# Altium schematic sheet MCU_USB.SchDoc
size A2; SheetNumber: 3; SheetTotal: 7
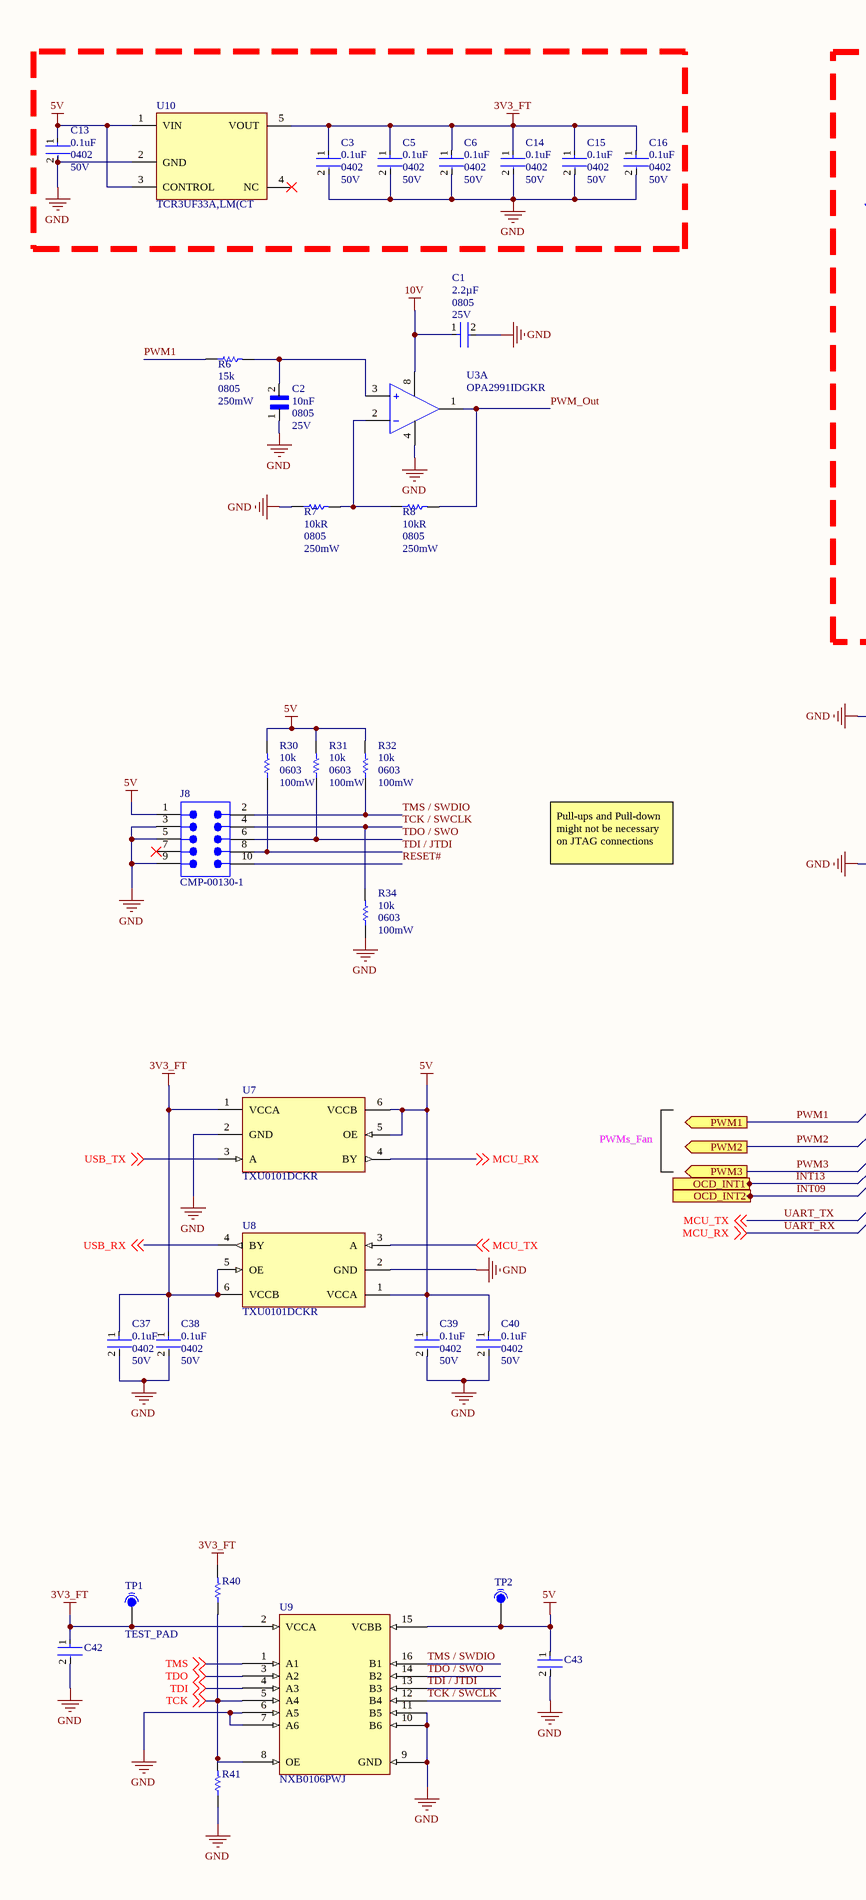
[diagram p0: MCU_USB.SchDoc, left]
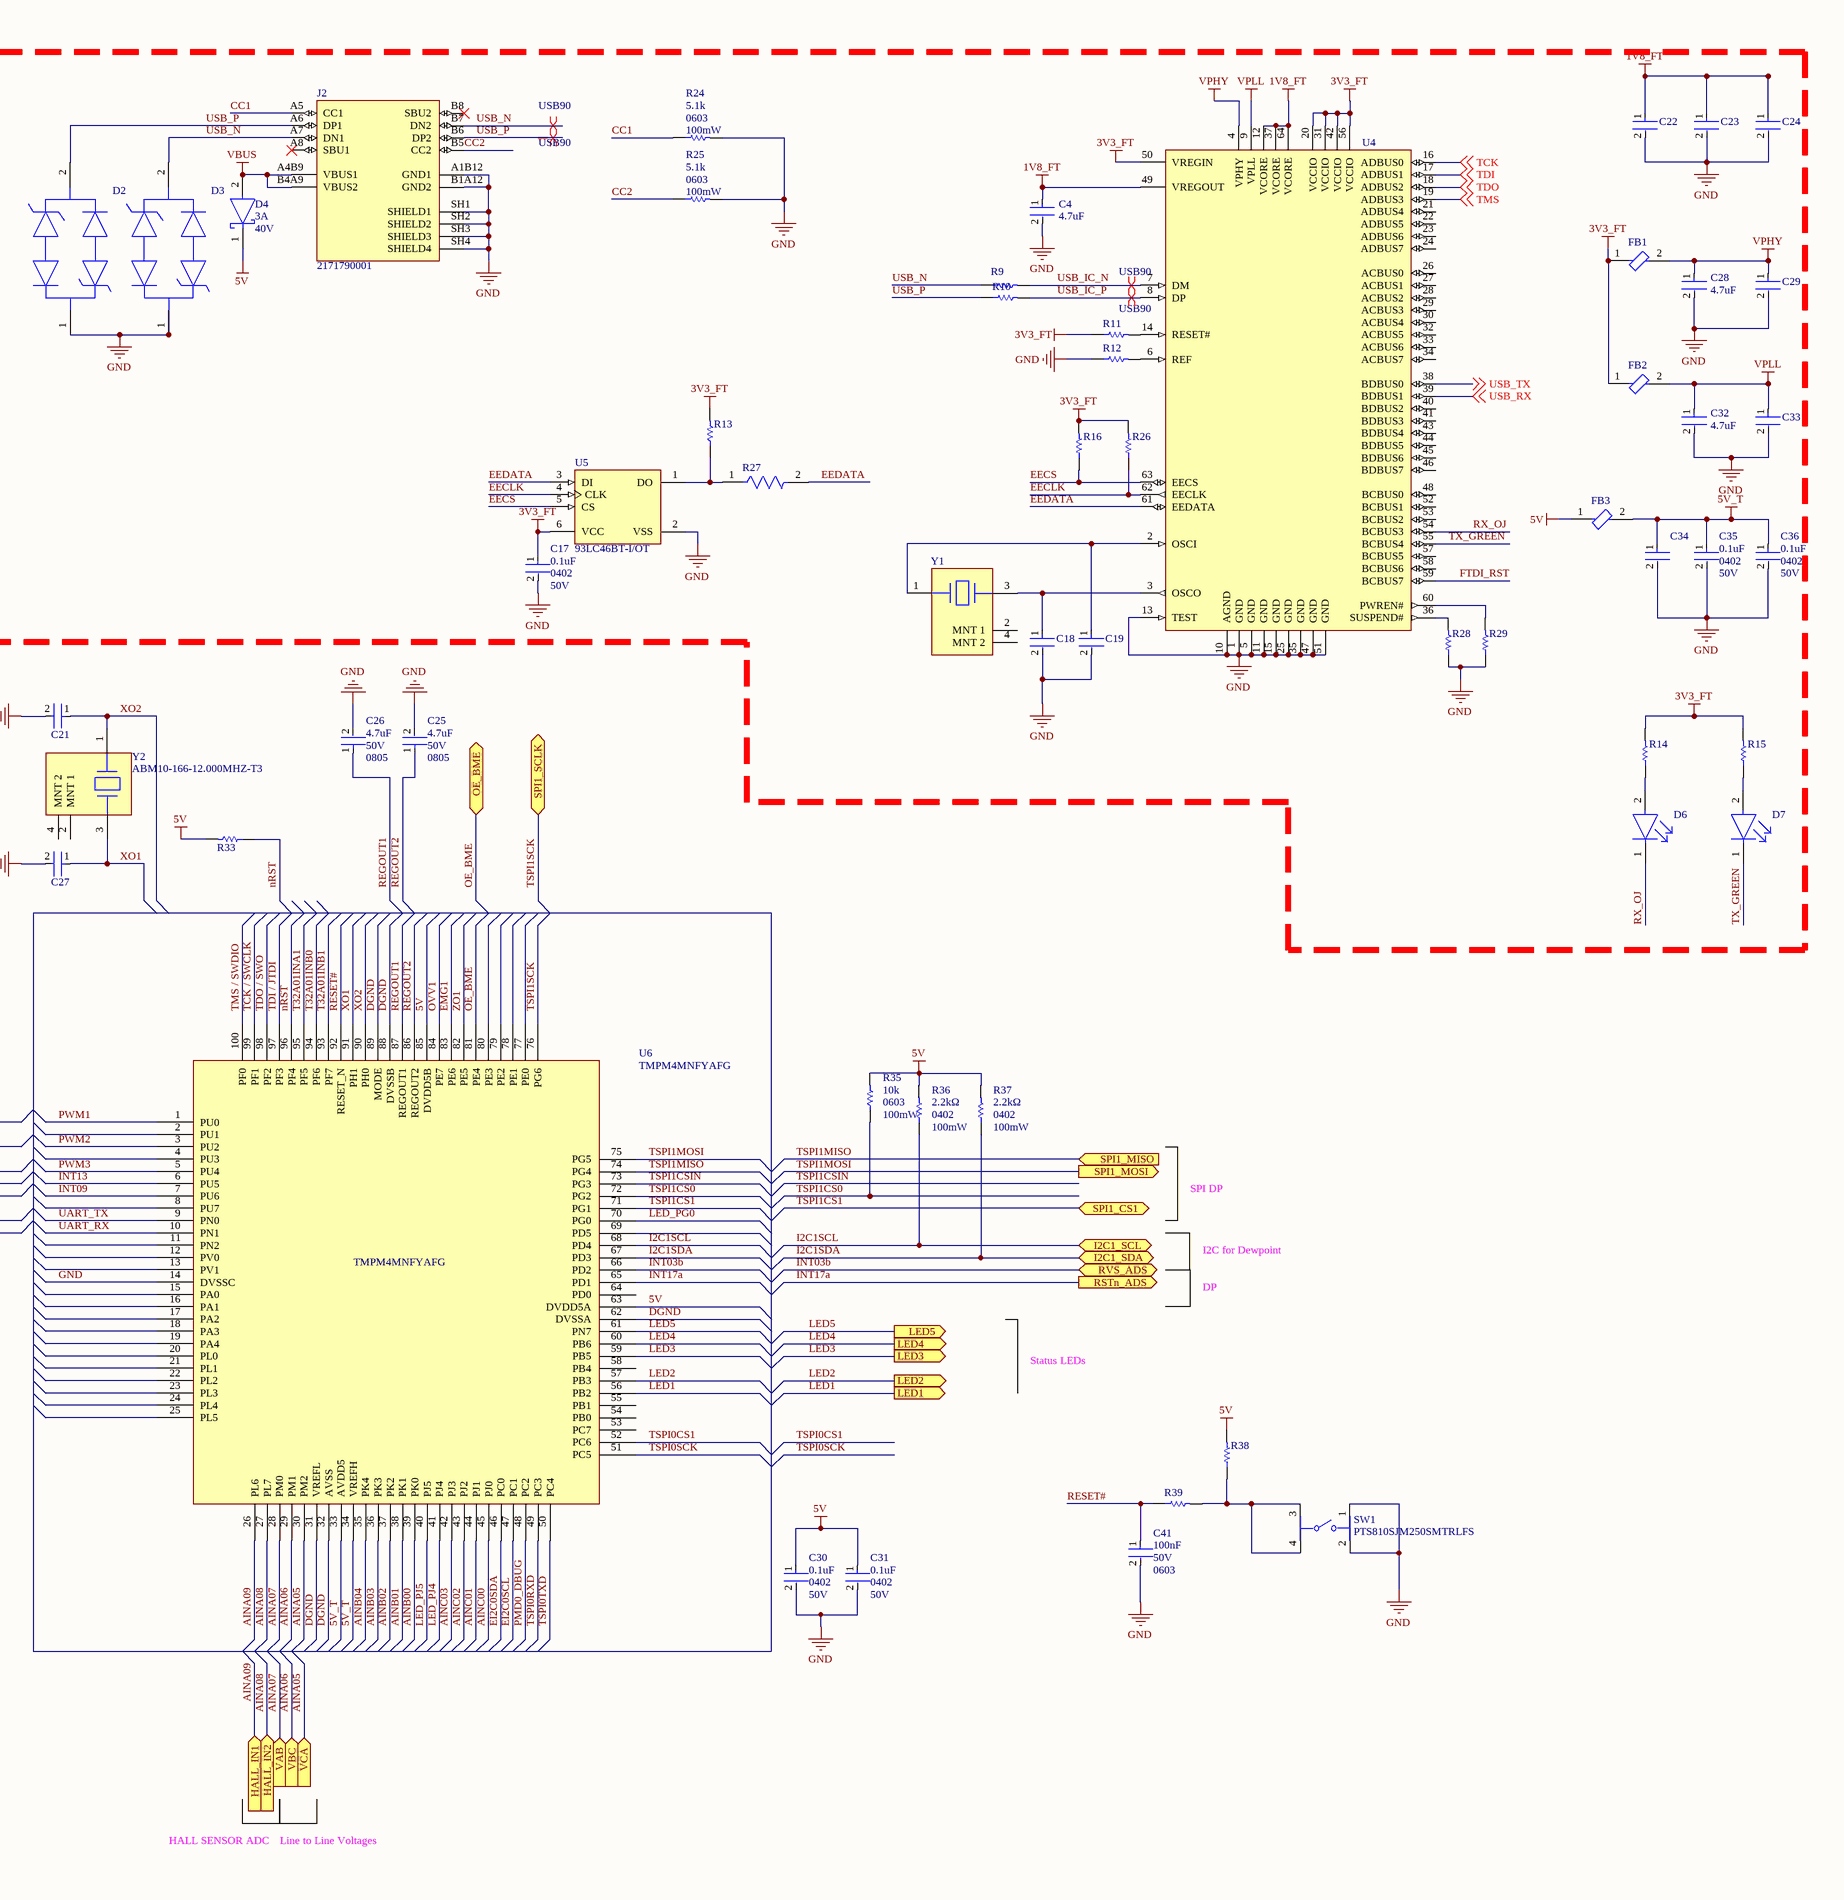
[diagram p1: MCU_USB.SchDoc, right]

## Parts
C1  value 2.2µF  Case/Package: 0805  Voltage Rating: 25V  [FP-0805-L_2_01_0_2-W_1_25-IPC_A]  (hidden comment: 08053C225KAT2A)
C2  value 10nF  Case/Package: 0805  Voltage Rating: 25V  [C0805C103J3GECAUTO-Footprint-1]  (hidden comment: C0805C103J3GECAUTO)
C3  value 0.1uF  Rating: 50V  Package: 0402  [FP-CGA2B-MFG]  (hidden comment: CGA2B3X7R1H104K050BB)
C4  Capacitance: 4.7uF  [FP-GRM21B-0_15-IPC_B]  (hidden comment: GRM21BR61H475KE51L)
C5  value 0.1uF  Rating: 50V  Package: 0402  [FP-CGA2B-MFG]  (hidden comment: CGA2B3X7R1H104K050BB)
C6  value 0.1uF  Rating: 50V  Package: 0402  [FP-CGA2B-MFG]  (hidden comment: CGA2B3X7R1H104K050BB)
C13  value 0.1uF  Rating: 50V  Package: 0402  [FP-CGA2B-MFG]  (hidden comment: CGA2B3X7R1H104K050BB)
C14  value 0.1uF  Rating: 50V  Package: 0402  [FP-CGA2B-MFG]  (hidden comment: CGA2B3X7R1H104K050BB)
C15  value 0.1uF  Rating: 50V  Package: 0402  [FP-CGA2B-MFG]  (hidden comment: CGA2B3X7R1H104K050BB)
C16  value 0.1uF  Rating: 50V  Package: 0402  [FP-CGA2B-MFG]  (hidden comment: CGA2B3X7R1H104K050BB)
C17  value 0.1uF  Rating: 50V  Package: 0402  [FP-CGA2B-MFG]  (hidden comment: CGA2B3X7R1H104K050BB)
C18  CBR08C809CAGAC  [FP-CBR08C-MFG]  (value not drawn)
C19  CBR08C809CAGAC  [FP-CBR08C-MFG]  (value not drawn)
C21  C0805C180K5GACTU  [FP-C0805C-DN-MFG]  (value not drawn)
C22  08055C104KAT2A  [FP-0805-L_2_01_0_2-W_1_25-IPC_C]  (value not drawn)
C23  08055C104KAT2A  [FP-0805-L_2_01_0_2-W_1_25-IPC_C]  (value not drawn)
C24  08055C104KAT2A  [FP-0805-L_2_01_0_2-W_1_25-IPC_C]  (value not drawn)
C25  Case/Package: 0805  Capacitance: 4.7uF  Voltage Rating: 50V  [FP-GRM21B-0_15-IPC_B]  (hidden comment: GRM21BR61H475KE51L)
C26  Case/Package: 0805  Capacitance: 4.7uF  Voltage Rating: 50V  [FP-GRM21B-0_15-IPC_B]  (hidden comment: GRM21BR61H475KE51L)
C27  C0805C180K5GACTU  [FP-C0805C-DN-MFG]  (value not drawn)
C28  Capacitance: 4.7uF  [FP-GRM21B-0_15-IPC_B]  (hidden comment: GRM21BR61H475KE51L)
C29  08055C104KAT2A  [FP-0805-L_2_01_0_2-W_1_25-IPC_C]  (value not drawn)
C30  value 0.1uF  Rating: 50V  Package: 0402  [FP-CGA2B-MFG]  (hidden comment: CGA2B3X7R1H104K050BB)
C31  value 0.1uF  Rating: 50V  Package: 0402  [FP-CGA2B-MFG]  (hidden comment: CGA2B3X7R1H104K050BB)
C32  Capacitance: 4.7uF  [FP-GRM21B-0_15-IPC_B]  (hidden comment: GRM21BR61H475KE51L)
C33  08055C104KAT2A  [FP-0805-L_2_01_0_2-W_1_25-IPC_C]  (value not drawn)
C34  GRM21BR61C106KE15K  [FP-GRM21B-0_1-MFG]  (value not drawn)
C35  value 0.1uF  Rating: 50V  Package: 0402  [FP-CGA2B-MFG]  (hidden comment: CGA2B3X7R1H104K050BB)
C36  value 0.1uF  Rating: 50V  Package: 0402  [FP-CGA2B-MFG]  (hidden comment: CGA2B3X7R1H104K050BB)
C37  value 0.1uF  Rating: 50V  Package: 0402  [FP-CGA2B-MFG]  (hidden comment: CGA2B3X7R1H104K050BB)
C38  value 0.1uF  Rating: 50V  Package: 0402  [FP-CGA2B-MFG]  (hidden comment: CGA2B3X7R1H104K050BB)
C39  value 0.1uF  Rating: 50V  Package: 0402  [FP-CGA2B-MFG]  (hidden comment: CGA2B3X7R1H104K050BB)
C40  value 0.1uF  Rating: 50V  Package: 0402  [FP-CGA2B-MFG]  (hidden comment: CGA2B3X7R1H104K050BB)
C41  value 100nF  Voltage Rating: 50V  Case/Package: 0603  [FP-C0603C-CF-IPC_A]  (hidden comment: C0603C104K5RACTU)
C42  08055C104KAT2A  [FP-0805-L_2_01_0_2-W_1_25-IPC_C]  (value not drawn)
C43  08055C104KAT2A  [FP-0805-L_2_01_0_2-W_1_25-IPC_C]  (value not drawn)
D2  CDSOD323-T05C  [FP-SOD-323-IPC_A]  (value not drawn)
D3  CDSOD323-T05C  [FP-SOD-323-IPC_A]  (value not drawn)
D4  value 3A  Voltage Rating: 40V  [FP-SOD123W-MFG]  (hidden comment: PMEG4030ER,115)
D6  APT3216LSECK/J4-PRV  [FP-APT3216LSECK-J4-PRV-MFG]  (value not drawn)
D7  APT3216LZGCK  [FP-APT3216LSECK-J4-PRV-MFG]  (value not drawn)
FB1  BLM21PG300SN1D  [FP-BLM21-0_2-t0_85-e0_5-d-MFG]  (value not drawn)
FB2  BLM21PG300SN1D  [FP-BLM21-0_2-t0_85-e0_5-d-MFG]  (value not drawn)
FB3  MPZ2012S221AT000  [FP-MPZ2012-MFG]  (value not drawn)
J2  2171790001  [2171790001-Footprint-1]
J8  CMP-00130-1  [FP-M50-3600542R-MFG]
R6  value 15k  Case/Package: 0805  Power: 250mW  [RESC2013X60X30ML20T20]  (hidden comment: RK73H2ATTD1502F)
R7  value 10kR  Max Power Dissipation: 250mW  Case Code (Imperial): 0805  [RESC2013X60X30ML20T20]  (hidden comment: RK73H2ATTD1002F)
R8  value 10kR  Max Power Dissipation: 250mW  Case Code (Imperial): 0805  [RESC2013X60X30ML20T20]  (hidden comment: RK73H2ATTD1002F)
R9  RK73B2ATTD270J  [RESC2013X60X30ML20T20]  (value not drawn)
R10  RK73B2ATTD270J  [RESC2013X60X30ML20T20]  (value not drawn)
R11  RC0805FR-071KL  [RESC2013X60X35ML10T20]  (value not drawn)
R12  ERJ-6GEYJ123V  [RESC2013X70X40ML20T20]  (value not drawn)
R13  RK73H2ATTD1002F  [RESC2013X60X30LL20T20]  (value not drawn)
R14  RC0805FR-071KL  [RESC2013X60X35ML10T20]  (value not drawn)
R15  RC0805FR-071KL  [RESC2013X60X35ML10T20]  (value not drawn)
R16  RK73H2ATTD1002F  [RESC2013X60X30LL20T20]  (value not drawn)
R24  value 5.1k  Case/Package: 0603  Power: 100mW  [RESC1608X55X30LL20T10]  (hidden comment: RK73H1JTTD5101F)
R25  value 5.1k  Case/Package: 0603  Power: 100mW  [RESC1608X55X30LL20T10]  (hidden comment: RK73H1JTTD5101F)
R26  RK73H2ATTD1002F  [RESC2013X60X30LL20T20]  (value not drawn)
R27  RMCF0805JT2K20  [FP-RMCF0805-IPC_C]  (value not drawn)
R28  ERJ-6GEY0R00V  [RESC2013X70X40NL20T20]  (value not drawn)
R29  ERJ-6GEY0R00V  [RESC2013X70X40NL20T20]  (value not drawn)
R30  value 10k  Power: 100mW  Case/Package: 0603  [RESC1608X55X30LL20T10]  (hidden comment: RK73H1JTTD1002F)
R31  value 10k  Power: 100mW  Case/Package: 0603  [RESC1608X55X30LL20T10]  (hidden comment: RK73H1JTTD1002F)
R32  value 10k  Power: 100mW  Case/Package: 0603  [RESC1608X55X30LL20T10]  (hidden comment: RK73H1JTTD1002F)
R33  ERJ-6GEY0R00V  [RESC2013X70X40NL20T20]  (value not drawn)
R34  value 10k  Power: 100mW  Case/Package: 0603  [RESC1608X55X30LL20T10]  (hidden comment: RK73H1JTTD1002F)
R35  value 10k  Power: 100mW  Case/Package: 0603  [RESC1608X55X30LL20T10]  (hidden comment: RK73H1JTTD1002F)
R36  value 2.2kΩ  Package: 0402  Rating: 100mW  [RK73H1ETTP2201F-Footprint-1]  (hidden comment: RK73H1ETTP2201F)
R37  value 2.2kΩ  Package: 0402  Rating: 100mW  [RK73H1ETTP2201F-Footprint-1]  (hidden comment: RK73H1ETTP2201F)
R38  RK73H2ATTD1002F  [RESC2013X60X30LL20T20]  (value not drawn)
R39  ERJ-6GEYJ331V  [RESC2013X70X40ML20T20]  (value not drawn)
R40  RK73H2ATTD1002F  [RESC2013X60X30LL20T20]  (value not drawn)
R41  ERJ-6GEY0R00V  [RESC2013X70X40NL20T20]  (value not drawn)
SW1  PTS810SJM250SMTRLFS  [FP-PTS810SJM250SMTRLFS-MFG]
TP1  TEST_PAD  [TEST_PAD-Footprint-1]
TP2  TEST_PAD  [TEST_PAD-Footprint-1]  (value not drawn)
U3  OPA2991IDGKR  [FP-DGK0008A-IPC_B]  (part A of 2)
U4  FT2232HL-REEL  [LQFP-64_M]  (value not drawn)
U5  93LC46BT-I/OT  [SOT-23-OT6_M]
U6  TMPM4MNFYAFG  [TSQFP50P1600X1600X145-100N]
U7  TXU0101DCKR  [FP-DCK0006A-MFG]
U8  TXU0101DCKR  [FP-DCK0006A-MFG]
U9  NXB0106PWJ  [TSOP65P640X120-16N]
U10  TCR3UF33A,LM(CT  [TCR3UF33A,LM(CT-Footprint-1]
Y1  ABM10-166-12.000MHZ-T3  [FP-ABM10-166-167-MFG]  (value not drawn)
Y2  ABM10-166-12.000MHZ-T3  [FP-ABM10-166-167-MFG]

## Ports
HALL_IN1 (in), HALL_IN2 (in), I2C1_SCL (bidir), I2C1_SDA (bidir), LED1 (out), LED2 (out), LED3 (out), LED4 (out), LED5 (out), OCD_INT1 (in), OCD_INT2 (in), OE_BME (bidir), PWM1 (out), PWM2 (out), PWM3 (out), RSTn_ADS (out), RVS_ADS (bidir), SPI1_CS1 (bidir), SPI1_MISO (in), SPI1_MOSI (out), SPI1_SCLK (bidir), VAB (in), VBC (in), VCA (in)

## Nets
1V8_FT: C4.1 C22.1 C23.1 C24.1 U4.12(VCORE) U4.37(VCORE) U4.49(VREGOUT) U4.64(VCORE)
3V3_FT: C3.1 C5.1 C6.1 C14.1 C15.1 C16.1 C17.1 C37.1 C38.1 C42.1 FB1.1 FB2.1 R11.1 R13.2 R14.2 R15.2 R16.2 R26.2 R40.2 TP1.1 U4.20(VCCIO) U4.31(VCCIO) U4.42(VCCIO) U4.50(VREGIN) U4.56(VCCIO) U5.6(VCC) U7.1(VCCA) U8.5(OE) U8.6(VCCB) U9.2(VCCA) U10.5(VOUT)
5V: C13.1 C30.1 C31.1 C39.1 C40.1 C43.1 D4.1(C) FB3.1 J8.1 R30.2 R31.2 R32.2 R33.2 R35.2 R36.2 R37.2 R38.2 TP2.1 U6.63(DVDD5A) U6.85(DVDD5B) U7.5(OE) U7.6(VCCB) U8.1(VCCA) U9.15(VCBB) U10.1(VIN) U10.3(CONTROL)
5V_T: C34.1 C35.1 C36.1 FB3.2 U6.33(AVDD5) U6.34(VREFH)
10V: C1.1 U3.8(v+)
GND: C1.2 C2.1 C3.2 C4.2 C5.2 C6.2 C13.2 C14.2 C15.2 C16.2 C17.2 C18.2 C19.2 C21.2 C22.2 C23.2 C24.2 C25.2 C26.2 C27.2 C28.2 C29.2 C30.2 C31.2 C32.2 C33.2 C34.2 C35.2 C36.2 C37.2 C38.2 C39.2 C40.2 C41.2 C42.2 C43.2 D2.1 D3.1 J2.A1B12(GND1) J2.B1A12(GND2) J2.SH1(SHIELD1) J2.SH2(SHIELD2) J2.SH3(SHIELD3) J2.SH4(SHIELD4) J8.3 J8.5 J8.9 R7.1 R12.1 R24.2 R25.2 R28.1 R29.1 R34.1 R41.1 SW1.1 SW1.2 U3.4(V-) U4.1(GND) U4.5(GND) U4.10(AGND) U4.11(GND) U4.13(TEST) U4.15(GND) U4.25(GND) U4.35(GND) U4.47(GND) U4.51(GND) U5.2(VSS) U6.14(DVSSC) U7.2(GND) U8.2(GND) U9.6(A5) U9.7(A6) U9.9(GND) U9.10(B6) U9.11(B5) U10.2(GND)
VBUS: D4.2(A) J2.A4B9(VBUS1) J2.B4A9(VBUS2)
VPHY: C28.1 C29.1 FB1.2 U4.4(VPHY)
VPLL: C32.1 C33.1 FB2.2 U4.9(VPLL)
AINA05: U6.30(PM2) ; port VCA
AINA06: U6.29(PM1) ; port VBC
AINA07: U6.28(PM0) ; port VAB
AINA08: U6.27(PL7) ; port HALL_IN2
AINA09: U6.26(PL6) ; port HALL_IN1
AINB00: U6.39(PK0)
AINB01: U6.38(PK1)
AINB02: U6.37(PK2)
AINB03: U6.36(PK3)
AINB04: U6.35(PK4)
AINC00: U6.45(PJ0)
AINC01: U6.44(PJ1)
AINC02: U6.43(PJ2)
AINC03: U6.42(PJ3)
CC1: J2.A5(CC1) R24.1
CC2: J2.B5(CC2) R25.1
DGND: U6.31(VREFL) U6.32(AVSS) U6.62(DVSSA) U6.88(DVSSB) U6.89(MODE)
EECLK: R26.1 U4.62(EECLK) U5.4(CLK)
EECS: R16.1 U4.63(EECS) U5.5(CS)
EEDATA: R27.2 U4.61(EEDATA) U5.3(DI)
EI2C0SCL: U6.47(PC1)
EI2C0SDA: U6.46(PC0)
EMG1: U6.83(PE6)
FTDI_RST: U4.59(BCBUS7)
I2C1SCL: R36.1 U6.68(PD4) ; port I2C1_SCL
I2C1SDA: R37.1 U6.67(PD3) ; port I2C1_SDA
INT03b: U6.66(PD2) ; port RVS_ADS
INT09: U6.7(PU6) ; port OCD_INT2
INT13: U6.6(PU5) ; port OCD_INT1
INT17a: U6.65(PD1) ; port RSTn_ADS
LED1: U6.56(PB2) ; port LED1
LED2: U6.57(PB3) ; port LED2
LED3: U6.59(PB5) ; port LED3
LED4: U6.60(PB6) ; port LED4
LED5: U6.61(PN7) ; port LED5
LED_PG0: U6.70(PG0)
LED_PJ4: U6.41(PJ4)
LED_PJ5: U6.40(PJ5)
nRST: R33.1 U6.96(PF4)
OE_BME: U6.81(PE4) ; port OE_BME
OVV1: U6.84(PE7)
PMD0_DBUG: U6.48(PC2)
PWM1: R6.1 U6.1(PU0) ; port PWM1
PWM2: U6.3(PU2) ; port PWM2
PWM3: U6.5(PU4) ; port PWM3
PWM_Out: R8.2 U3.1(OUT1)
REGOUT1: C26.1 U6.87(REGOUT1)
REGOUT2: C25.1 U6.86(REGOUT2)
RESET#: C41.1 J8.10 R39.1 U6.92(RESET_N)
RX_OJ: D6.1(C) U4.54(BCBUS3)
T32A01INA1: U6.95(PF5)
T32A01INB0: U6.94(PF6)
T32A01INB1: U6.93(PF7)
TCK: R40.1 R41.2 U4.16(ADBUS0) U9.5(A4) U9.8(OE) ; off-sheet TCK
TCK / SWCLK: J8.4 R34.2 U6.99(PF1) U9.12(B4)
TDI: U4.17(ADBUS1) U9.4(A3) ; off-sheet TDI
TDI / JTDI: J8.8 R30.1 U6.97(PF3) U9.13(B3)
TDO: U4.18(ADBUS2) U9.3(A2) ; off-sheet TDO
TDO / SWO: J8.6 R31.1 U6.98(PF2) U9.14(B2)
TMS: U4.19(ADBUS3) U9.1(A1) ; off-sheet TMS
TMS / SWDIO: J8.2 R32.1 U6.100(PF0) U9.16(B1)
TSPI0CS1: U6.52(PC6)
TSPI0RXD: U6.49(PC3)
TSPI0SCK: U6.51(PC5)
TSPI0TXD: U6.50(PC4)
TSPI1CS0: R35.1 U6.72(PG2)
TSPI1CS1: U6.71(PG1) ; port SPI1_CS1
TSPI1CSIN: U6.73(PG3)
TSPI1MISO: U6.74(PG4) ; port SPI1_MISO
TSPI1MOSI: U6.75(PG5) ; port SPI1_MOSI
TSPI1SCK: U6.76(PG6) ; port SPI1_SCLK
TX_GREEN: D7.1(C) U4.55(BCBUS4)
UART_RX: U6.10(PN1) U7.4(BY) ; off-sheet MCU_RX  [also labelled MCU_RX]
UART_TX: U6.9(PN0) U8.3(A) ; off-sheet MCU_TX  [also labelled MCU_TX]
USB_IC_N: R9.2 U4.7(DM)
USB_IC_P: R10.2 U4.8(DP)
USB_N: D3.2 J2.A7(DN1) J2.B7(DN2) R9.1
USB_P: D2.2 J2.A6(DP1) J2.B6(DP2) R10.1
USB_RX: U4.39(BDBUS1) U8.4(BY) ; off-sheet USB_RX
USB_TX: U4.38(BDBUS0) U7.3(A) ; off-sheet USB_TX
XO1: C27.1 U6.91(PH1) Y2.3
XO2: C21.1 U6.90(PH0) Y2.1
ZO1: U6.82(PE5)
NetC2_2: C2.2 R6.2 U3.3(IN1+)
NetC18_1: C18.1 U4.3(OSCO) Y1.3
NetC19_1: C19.1 U4.2(OSCI) Y1.1
NetD6_2: D6.2(A) R14.1
NetD7_2: D7.2(A) R15.1
NetR7_2: R7.2 R8.1 U3.2(IN1-)
NetR11_2: R11.2 U4.14(RESET#)
NetR12_2: R12.2 U4.6(REF)
NetR13_1: R13.1 R27.1 U5.1(DO)
NetR28_2: R28.2 U4.36(SUSPEND#)
NetR29_2: R29.2 U4.60(PWREN#)
NetR38_1: R38.1 R39.2 SW1.3 SW1.4

Not connected (* = marked no-connect by the designer): J2 A8(SBU1)* B8(SBU2)*; J8 7*; U4 21(ADBUS4) 22(ADBUS5) 23(ADBUS6) 24(ADBUS7) 26(ACBUS0) 27(ACBUS1) 28(ACBUS2) 29(ACBUS3) 30(ACBUS4) 32(ACBUS5) 33(ACBUS6) 34(ACBUS7) 40(BDBUS2) 41(BDBUS3) 43(BDBUS4) 44(BDBUS5) 45(BDBUS6) 46(BDBUS7) 48(BCBUS0) 52(BCBUS1) 53(BCBUS2) 57(BCBUS5) 58(BCBUS6); U6 2(PU1) 4(PU3) 8(PU7) 11(PN2) 12(PV0) 13(PV1) 15(PA0) 16(PA1) 17(PA2) 18(PA3) 19(PA4) 20(PL0) 21(PL1) 22(PL2) 23(PL3) 24(PL4) 25(PL5) 53(PC7) 54(PB0) 55(PB1) 58(PB4) 64(PD0) 69(PD5) 77(PE0) 78(PE1) 79(PE2) 80(PE3); U10 4(NC)*; Y1 2(MNT_1) 4(MNT_2); Y2 2(MNT_1) 4(MNT_2)

## Layout directives
differential pair; differential pair class USB90: USB_IC_N, USB_IC_P, USB_N, USB_P

## Notes on the sheet
- Pull-ups and Pull-down might not be necessary on JTAG connections
- PWMs_Fan
- SPI DP
- I2C for Dewpoint
- DP
- Status LEDs
- HALL SENSOR ADC
- Line to Line Voltages
- Title:
- Date:
- Drawn By:
- File:
- Time:
- Checked By:
- Sheet
- of

## Library data of the parts
C1 = CMP-001-00310-1: Ceramic Capacitor, Multilayer, Ceramic, 25V, 10% +Tol, 10% -Tol, X7R, 15% TC, 2.2uF, Surface Mount, 0805; RoHS Compliant: Yes; Max Operating Temperature: 125°C; Capacitor Type: Ceramic; Mounting Technology: Surface Mount; Min Operating Temperature: -55°C; Pins: 2
C2 = CMP-001-00309-1: Ceramic Capacitor, Multilayer, Ceramic, 25V, 5% +Tol, 5% -Tol, C0G, 30ppm/Cel TC, 0.01uF, Surface Mount, 0805; Capacitor Type: Ceramic; Pins: 2; RoHS Compliant: Yes
C3 C5 C6 C13-C17 C30 C31 C35-C40 = CMP-001-00144-1: Multilayer Ceramic Capacitor, 0.1 uF, 50 V, ± 10%, X7R, 0402 [1005 Metric]; Catgeory: Capacitors; Vendor: Mouser; Price: $0.023
C4 C25 C26 C28 C32 = CMP-06035-059131-1: Chip Multilayer Ceramic Capacitors for General Purpose, 0805, 4.7uF, X5R, 15%, 10%, 50V; Case Code (Metric): 2012; Height: 1.25mm; Width: 0.049inch; Packaging: Tape and Reel; Mount: Surface Mount; REACH SVHC: No SVHC; Case Code (Imperial): 0805; Dielectric: X5R; Thickness: 0.055inch; Material: Ceramic; Depth: 1.25mm; Min Operating Temperature: -55°C; Lead Free: Lead Free; Max Operating Temperature: 85°C; Tolerance: 10%; Length: 2mm; Voltage Rating (DC): 50V
  C4 C28 C32: Case/Package: 0805; Voltage Rating: 50V
C18 C19 = CMP-03020-029170-1: CAP CER 8PF 250V C0G/NP0 0805; Manufacturer: KEMET; Temperature Coefficient: 30ppm/°C; Value: 8.0 pF; Tolerance: 0.25 pF; Temperature Characteristic: C0G; Material: Ceramic; Device Class L1: Passive Components; Automotive: No; Height: 0.95mm; Octopart: https://octopart.com/cbr08c809cagac-kemet-23841681; Digikey Description: CAP CER 8PF 250V C0G/NP0 0805; Manufacturer Part Number: CBR08C809CAGAC; Device Class L3: Ceramic Capacitors; Package: CBR08C; ComponentLink2Description: Datasheet; Temperature Range High: +125°C; Category: Cap; Mouser Description: Multilayer Ceramic Capacitors MLCC - SMD/SMT 250volts 8pF C0G 0805 .25pF Tol RF; Lead Free: Yes; Device Class L2: Capacitors; Ipc Land Pattern Name: CAPC200125X85; Temperature Range Low: -55°C; Voltage Rating: 250 V; Temperature: -55°C to +125°C; Capacitance: 8.0 pF; ComponentLink2URL: https://content.kemet.com/datasheets/KEM_C1030_CBR_SMD.pdf; RoHS: TRUE
C21 C27 = CMP-1036-01146-3: CAP CER 18PF 50V 10% NP0 0805; Manufacturer: KEMET; Tolerance: 0.1; Material: Ceramic; Temperature Coefficient: 30ppm/°C; Temperature Characteristic: C0G; Mouser Description: Multilayer Ceramic Capacitors MLCC - SMD/SMT 50volts 18pF C0G 10%; Category: Cap; Automotive: No; Device Class L1: Passive Components; Height: 0.88mm; RoHS: TRUE; Manufacturer Part Number: C0805C180K5GACTU; Octopart: https://octopart.com/c0805c180k5gactu-kemet-6728804; Ipc Land Pattern Name: CAPC200125X78; Voltage Rating: 50 V; ComponentLink2URL: https://content.kemet.com/datasheets/KEM_C1003_C0G_SMD.pdf; ComponentLink2Description: Datasheet; Value: 18 pF; Temperature Range Low: -55°C; Digikey Description: CAP CER 18PF 50V 10% NP0 0805; Lead Free: Yes; Temperature Range High: +125°C; Device Class L2: Capacitors; Device Class L3: Ceramic Capacitors; Temperature: -55°C to +125°C; Capacitance: 18 pF; Package: C0805C-DN
C22-C24 C29 C33 C42 C43 = CMP-2000-05016-2: General Purpose Ceramic Capacitor, 0805, 100nF, 10%, X7R, 0.15, 50V; Dissipation Factor: 2.5%; Insulation Resistance: 100GR; Voltage Rating (DC): 50V; Package Quantity: 4000; Tolerance: 10%; Voltage Rating: 50V; Dielectric: X7R; Case/Package: 0805; Lead Free: Lead Free; Dielectric Material: Ceramic; Thickness: 0.037inch; Weight: 0.001411oz; Max Operating Temperature: 125°C; REACH SVHC: No SVHC; Mount: Surface Mount; RoHS Compliant: Yes; Depth: 1.25mm; Height: 0.5mm; Case Code (Metric): 2012; Length: 2mm; Termination: Standard; Case Code (Imperial): 0805; Number of Pins: 2; Voltage: 50V; Radiation Hardening: No; Min Operating Temperature: -55°C; Capacitance: 100nF; Width: 1.2mm; Series: MLCC X7R; Packaging: Cut Tape
C34 = CMP-2007-03534-2: Chip Multilayer Ceramic Capacitors for General Purpose, 0805, 10uF, X5R, 15%, 10%, 16V; Case Code (Imperial): 0805; Packaging: Tape and Reel; Width: 0.049inch; Depth: 1.25mm; Voltage Rating: 16V; Height: 1.25mm; Case/Package: 0805; Max Operating Temperature: 85°C; Min Operating Temperature: -55°C; Tolerance: 10%; Dielectric: X5R; REACH SVHC: No SVHC; Mount: Surface Mount; Radiation Hardening: No; Case Code (Metric): 2012; Length: 2mm; Package Quantity: 10000; Voltage Rating (DC): 16V; Voltage: 16V; Capacitance: 10uF; Thickness: 0.053inch; Termination: SMD/SMT
C41 = CMP-001-00325-1: Ceramic Capacitor, Multilayer, Ceramic, 50V, 10% +Tol, 10% -Tol, X7R, 15% TC, 0.1uF, Surface Mount, 0603; Pins: 2; Capacitor Type: Ceramic; Mounting Technology: Surface Mount; Min Operating Temperature: -55°C; Max Operating Temperature: 125°C; RoHS Compliant: Yes
D2 D3 = CMP-004-00086-1: Trans Voltage Suppressor Diode, 350W, 5V V(RWM), Bidirectional, 2 Element, Silicon; RoHS Compliant: Yes; Min Operating Temperature: -55°C; Max Operating Temperature: 150°C; Pins: 2
D4 = CMP-x00083-1: Rectifier Diode, Schottky, 1 Phase, 1 Element, 3A, 40V V(RRM), Silicon; Manufacturer: Nexperia; Reel Width: 8mm; Template: NX_SOD_123W_2; Vendor: TTI; Category: Diodes; MOQ: 3000; Mounting: SMT; Package: SOD-123W-2; Price: 0.072
D6 D7 = CMP-44529-000067-1: LED ORANGE CLEAR 2SMD; Lens Color: Colorless; Viewing Angle: 120°; Test Current: 2mA; Forward Voltage: 1.8V; Luminous Intensity: 50mcd; Dominant Wavelength: 605nm; Case/Package: 1206; Length: 3.2mm; Width: 1.6mm; Case Code (Imperial): 1206; Mount: Surface Mount; RoHS Compliant: Yes; Lens Transparency: Clear; Case Code (Metric): 3216; Packaging: Tape and Reel; Height: 0.75mm; Color: Orange
FB1 FB2 = CMP-0686-00620-3: Chip Ferrite Bead, 0805, 30Ω @ 100MHz, 0.014Ω, , 4A; Tolerance: 25%; Number of Circuits: 1; Impedance: 30R; Max DC Current: 3A; Shielding: Unshielded; Material: Steel; Resistance: 15mR; DC Resistance-Max: 14mR; Series: BLM21P; Military Standard: Not; Max Current Rating: 4A; Termination: SMD/SMT; Length: 2mm; Width: 1.25mm; Test Frequency: 100MHz; Packaging: Tape and Reel; Case/Package: 0805; Current Rating: 4A; Depth: 1.25mm; Package Quantity: 1; REACH SVHC: No SVHC; Core Material: Ferrite; Max Operating Temperature: 125°C; DC Current: 3A; Height: 0.85mm; Frequency: 100MHz; Number of Lines: 1; Case Code (Metric): 2012; Min Operating Temperature: -55°C; Radiation Hardening: No; Case Code (Imperial): 0805; Number of Pins: 2; RoHS Compliant: Yes; DC Resistance (DCR): 14mR; Lead Free: Lead Free
FB3 = CMP-08257-000020-1: FERRITE BEAD 220 OHM 0805 1LN; Test Frequency: 100MHz; Max DC Current: 3A; Tolerance: 25%; Impedance: 220R; DC Resistance (DCR): 40mR; Case/Package: 0805; Mount: Surface Mount; Termination: SMD/SMT; Packaging: Tape and Reel; Core Material: Ferrite; Case Code (Metric): 2012; Length: 0.079inch; Width: 0.049inch; Case Code (Imperial): 0805; REACH SVHC: No SVHC; Weight: 0.000194oz; Current Rating: 3A; Min Operating Temperature: -55°C; Lead Free: Lead Free; Package Quantity: 4000; Max Operating Temperature: 125°C; RoHS Compliant: Yes; Depth: 1.25mm; Height: 0.85mm
J2 = CMP-x00034-4: Top-mount SMT 16pos (Type C; Manufacturer: MOLEX; Rating: 0.431; Template: ML_USBC; Reel Width: 24mm; Vendor: TTi; Package: USB C; Mounting: SMT_Top_USB; MOQ: 1200; Value: 16POS
J8 = CMP-002-00657-1: Board Connector, 10 Contact(s), 2 Row(s), Female, Straight, 0.05 inch Pitch, Surface Mount Terminal, Locking, Black Insulator, Socket; Vendor: TTI; Reel Size: 16mm; Rating: 1A; Mounting: SMT; Price @ MOQ: 0.86; MOQ: 800; Price Floor Quantity: 8000; Category: Connector; Price Floor: 0.75; Case/Package: [5 x 2] 1.27mm; Design Item ID: CMP-00130-1; Source: Components - 07.02.25 - 13.24.SchLib
R6 = CMP-009-00996-1: Fixed Resistor, Metal Glaze/thick Film, 0.25W, 15000ohm, 150V, 1% +/-Tol, 100ppm/Cel, Surface Mount, 0805; Min Operating Temperature: -55°C; Pins: 2; Tolerance: 1%; Max Operating Temperature: 155°C; RoHS Compliant: Yes; Mounting Technology: Surface Mount
R7 R8 = CMP-00096-01-A-1: Resistor Thick Film 0805 10K Ohm 1% 1/8W ±100ppm/°C SMD Punched Paper Tape and Reel; Power Rating: 125mW; Voltage Rating (DC): 150V; Temperature Coefficient: 100ppm/°C; Termination: SMD/SMT; Ratings: AEC-Q200; Max Operating Temperature: 155°C; Features: Moisture Resistant,Automotive AEC-Q200; Pins: 2; Min Operating Temperature: -55°C; Resistance Tolerance: 1%; Case Code (Metric): 2012; Construction: Rectangular; Packaging: Tape and Reel; Tolerance: 1%; Reach SVHC Compliant: Unknown; Resistor Type: Thick Film; Height: 0.5mm; Case/Package: 0805; Length: 2mm; Military Standard: Not; Series: RK73H; Lead Free: Lead Free; Depth: 1.25mm; Number of Terminations: 2; Width: 1.25mm; Package Quantity: 5000; Voltage Rating: 150V
R9 R10 = CMP-2001-01809-1: Manufacturer: KOA Speer; Part Number: RK73B2ATTD270J
R11 R14 R15 = CMP-2100-03671-1: Chip Resistor, 1 KOhm, +/- 1%, 125 mW, -55 to 155 degC, 0805 (2012 Metric), RoHS, Tape and Reel; Manufacturer: Yageo; Temperature Coefficient: 100ppm/degreesC; Voltage Rating (DC): 150V; Max Power Dissipation: 125mW; Resistance: 1KOhm; Number of Pins: 2; Number of Terminations: 2; Datasheet URL: http://www.yageo.com/NewPortal/yageodocoutput?fileName=/pdf/R-Chip/PYu-RC_Group_51_RoHS_L_5.pdf; Length: 0.079inch; Package Description: 2-Pin Surface Mounted Device, Body 2 x 1.25 mm; Depth: 1.25mm; Height: 0.024inch; Military Standard: Not; Case/Package: 0805; Package Reference: 0805; RoHSCompliant: true; Lead Free: LeadFree; Packaging: TapeandReel; Package Quantity: 1; Datasheet Version: Rev. 5, 10/2016; Tolerance: 1%; Min Operating Temperature: -55degC; Voltage Rating: 150V; Composition: ThickFilm; Case Code (Imperial): 0805; Power Rating: 125mW; Width: 0.049inch; Case Code (Metric): 2012; Manufacturer URL: http://www.yageo.com/; Max Operating Temperature: 155degC; REACH SVHC: Unknown; Termination: SMD/SMT
R12 = CMP-2001-00347-1: Manufacturer: Panasonic; Part Number: ERJ-6GEYJ123V
R13 R16 R26 R38 R40 = CMP-2001-01993-1: Manufacturer: KOA Speer; Part Number: RK73H2ATTD1002F
R24 R25 = CMP-009-01012-1: Fixed Resistor, Metal Glaze/thick Film, 0.1W, 5100ohm, 75V, 1% +/-Tol, 100ppm/Cel, Surface Mount, 0603; Mounting Technology: Surface Mount; Min Operating Temperature: -55°C; RoHS Compliant: Yes; Max Operating Temperature: 155°C; Tolerance: 1%; Pins: 2
R27 = CMP-26527-000088-1: 2.2kΩ ±5% 0.125W 0805 Thick Film Chip Resistor AEC-Q200 compliant; Resistance: 2.2kR; Power Rating: 125mW; Temperature Coefficient: 100ppm/°C; Depth: 1.25mm; Mount: Surface Mount; Length: 2mm; Construction: Rectangular; Max Operating Temperature: 155°C; Case Code (Metric): 2012; Radiation Hardening: No; Min Operating Temperature: -55°C; Series: RMCF; Contact Plating: Tin; Number of Terminations: 2; RoHS Compliant: Yes; Height: 0.026inch; Width: 0.049inch; Case Code (Imperial): 0805; Tolerance: 5%; Packaging: Tape and Reel; Case/Package: 0805; Lead Free: Lead Free; Size Code: 0805; Military Standard: Not; Max Power Dissipation: 125mW; Features: Automotive AEC-Q200; Resistor Type: Thick Film
R28 R29 R33 R41 = CMP-1665-00002-5: Chip Resistor, 0 Ohm, +/- 1%, 0.125 W, -55 to 155 degC, 0805 (2012 Metric), RoHS, Tape and Reel; Tolerance: 5%; Resistance: 0 Ohm; REACH SVHC: No SVHC; Min Operating Temperature: -55 degC; Case/Package: 0805; Packaging: Tape and Reel; Package Quantity: 5000; ComponentLink1Description: Manufacturer URL; PackageDescription: 2-Pin Surface Mount Device, Body 2 x 1.25 mm; Mounting Technology: Surface Mount; Max Operating Temperature: 155 degC; PartNumber: ERJ-6GEY0R00V; Width: 1.25 mm; RoHSCompliant: True; Height: 0.6 mm; ComponentLink1URL: http://www.panasonic.com/; ComponentLink2URL: http://industrial.panasonic.com/cdbs/www-data/pdf/RDA0000/AOA0000C84.pdf; Case Code (Imperial): 0805; DatasheetVersion: 03/2015; Length: 2 mm; Case Code (Metric): 2012; ComponentLink2Description: Datasheet; Radiation Hardening: No
R30-R32 R34 R35 = CMP-009-00986-1: Fixed Resistor, Metal Glaze/thick Film, 0.1W, 10000ohm, 75V, 1% +/-Tol, 100ppm/Cel, Surface Mount, 0603; Tolerance: 1%; Min Operating Temperature: -55°C; Max Operating Temperature: 155°C; Pins: 2; RoHS Compliant: Yes; Mounting Technology: Surface Mount
R36 R37 = CMP-x00008-4: Fixed Resistor, Metal Glaze/thick Film, 0.1W, 2200ohm, 75V, 1% +/-Tol, 100ppm/Cel, Surface Mount, 0402; Manufacturer: KOA Speer; Vendor: TTI; Reel Width: 8mm; Template: KS_0402_R; MOQ: 10000; Price: 0.00297; Category: Resistor; Mounting: SMT
R39 = CMP-1013-00062-2: Manufacturer: Panasonic; Part Number: ERJ-6GEYJ331V
SW1 = CMP-x00082-1: Keypad Switch, 1 Switches, SPST, Momentary-tactile, 0.05A, 16VDC, 1.57N, Solder Terminal, Surface Mount-straight; Manufacturer: C&K; Reel Width: 12mm; Vendor: TTI; Category: Switches; MOQ: 2900; Mounting: SMT; Package: SPST; Price: 0.233; Template: -; Value: -
TP1 TP2 = CMP-x00074-1: For use with : 0978-0-15-20-75-14-11-0 MillMaxCorp
U3 = CMP-x00101-1: Operational Amplifier, 2 Func, 750uV Offset-Max, PDSO8; Manufacturer: TI; Reel Width: 12mm; Template: TI_VSSOP; Category: IC; MOQ: 1; Mounting: SMT; Package: VSSOP; Price: 1.591; Vendor: TI
U4 = CMP-x00055-4: USB Bus Controller, CMOS, PQFP64; Manufacturer: FTDI; Value: 3 - 5.25V; Template: FT_LQPF_64; Vendor: Mouser; MOQ: 1000; Price: 6.26; Mounting: SMD; Package: LQFP-64; Category: IC
U5 = CMP-x00087-1: EEPROM, 64X16, Serial, CMOS, PDSO6; Manufacturer: Microchip Technology; Reel Width: 8mm; Template: MT_SOT_23_6; Vendor: Microchip Direct; Category: IC; MOQ: 30000; Mounting: SMT; Package: SOT-23-6
U6 = CMP-001-0044-8: Toshiba Micro
U7 U8 = CMP-x00221-2: Single channel fixed-direction level shifter 6-SC70 -40 to 125
U9 = CMP-x00220-1: NXB0106 - Dual supply translating transceiver; auto direction sensing; 3-state
U10 = CMP-x00051-5: (ldo) Linear Voltage Reg, Vin: 6; Manufacturer: Toshiba; Value: 5.5V; Template: TS_SOT_25; Vendor: TTI; Reel Width: 8mm; Mounting: SMT; Package: SOT-25; Price: 0.108; MOQ: 3000; Category: IC
Y1 Y2 = CMP-003-00032-4: Crystal 12MHz ±10ppm (Tol) ±10ppm (Stability) 8pF FUND 125Ohm 4-Pin SMD T/R; Manufacturer: TI; Vendor: TTI; Reel Size: 8mm; Template: TI_4_SMD; Category: Crystal; Price: 0.207; Rating: 8pF; MOQ: 3000; Value: 12MHz; Package: 4-SMD; Mounting Technology: SMT